# EAGLE design Proyecto_DE (EAGLE 9.5.2)
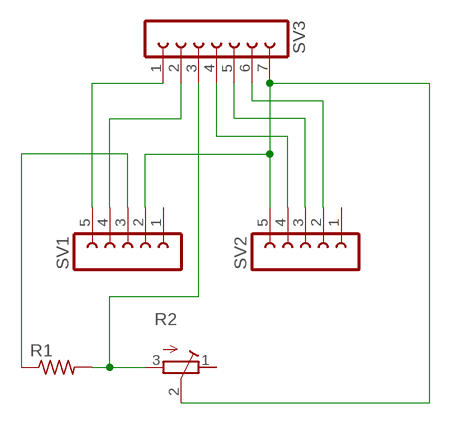
[diagram p0: schematic, sheet 1]

## Parts
R1  R-US_0207/12  [0207/12]
R2  R-TRIMMT93YA  [RTRIMT93YA]
SV1  FE05-1  [FE05-1]
SV2  FE05-1  [FE05-1]
SV3  FE07-1  [FE07]

## Nets
N$1: SV1.5 SV3.1
N$2: SV1.4 SV3.2
N$4: R1.1 SV1.3
N$5: R1.2 R2.3(A) SV3.3
N$7: SV2.4 SV3.4
N$9: SV2.3 SV3.5
N$10: R2.2(S) SV1.2 SV2.5 SV3.7
N$11: SV2.2 SV3.6
Unconnected: R2.1(E) SV1.1 SV2.1

## Library data of the parts
R1 = rcl:R-US_: RESISTOR, American symbol; SPICEPREFIX: R
R2 = rcl:R-TRIMM: Trimm resistor; SPICEMODEL: X; SPICEPREFIXL: POT
SV1 SV2 = con-lsta:FE05-1: FEMALE HEADER; OC_FARNELL: unknown; OC_NEWARK: unknown
SV3 = con-lsta:FE07-1: FEMALE HEADER; OC_FARNELL: unknown; OC_NEWARK: unknown

## Board
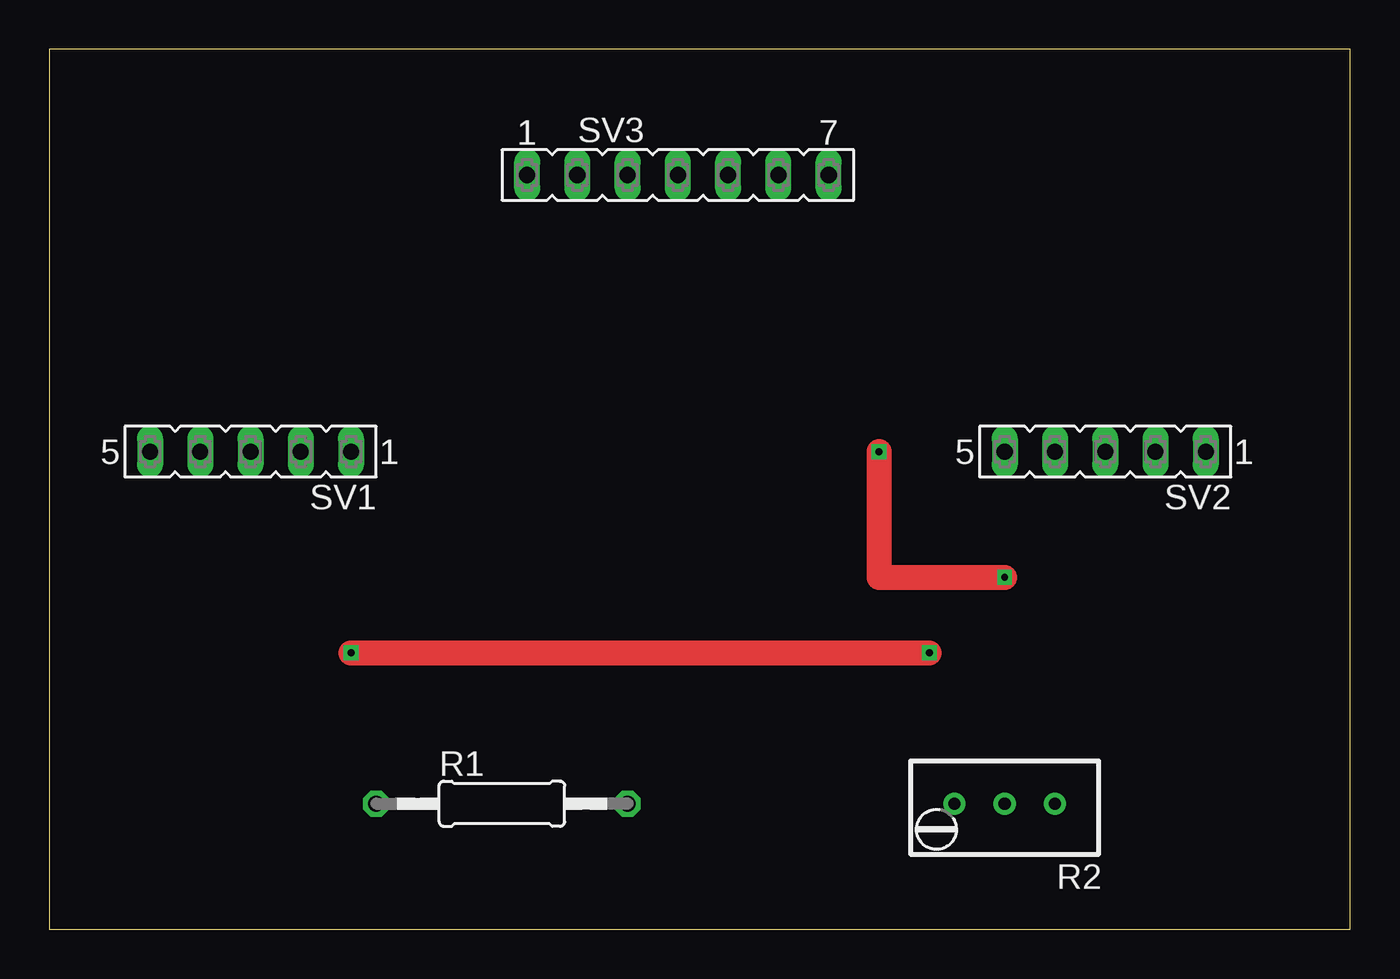
[diagram p1: board, top side]
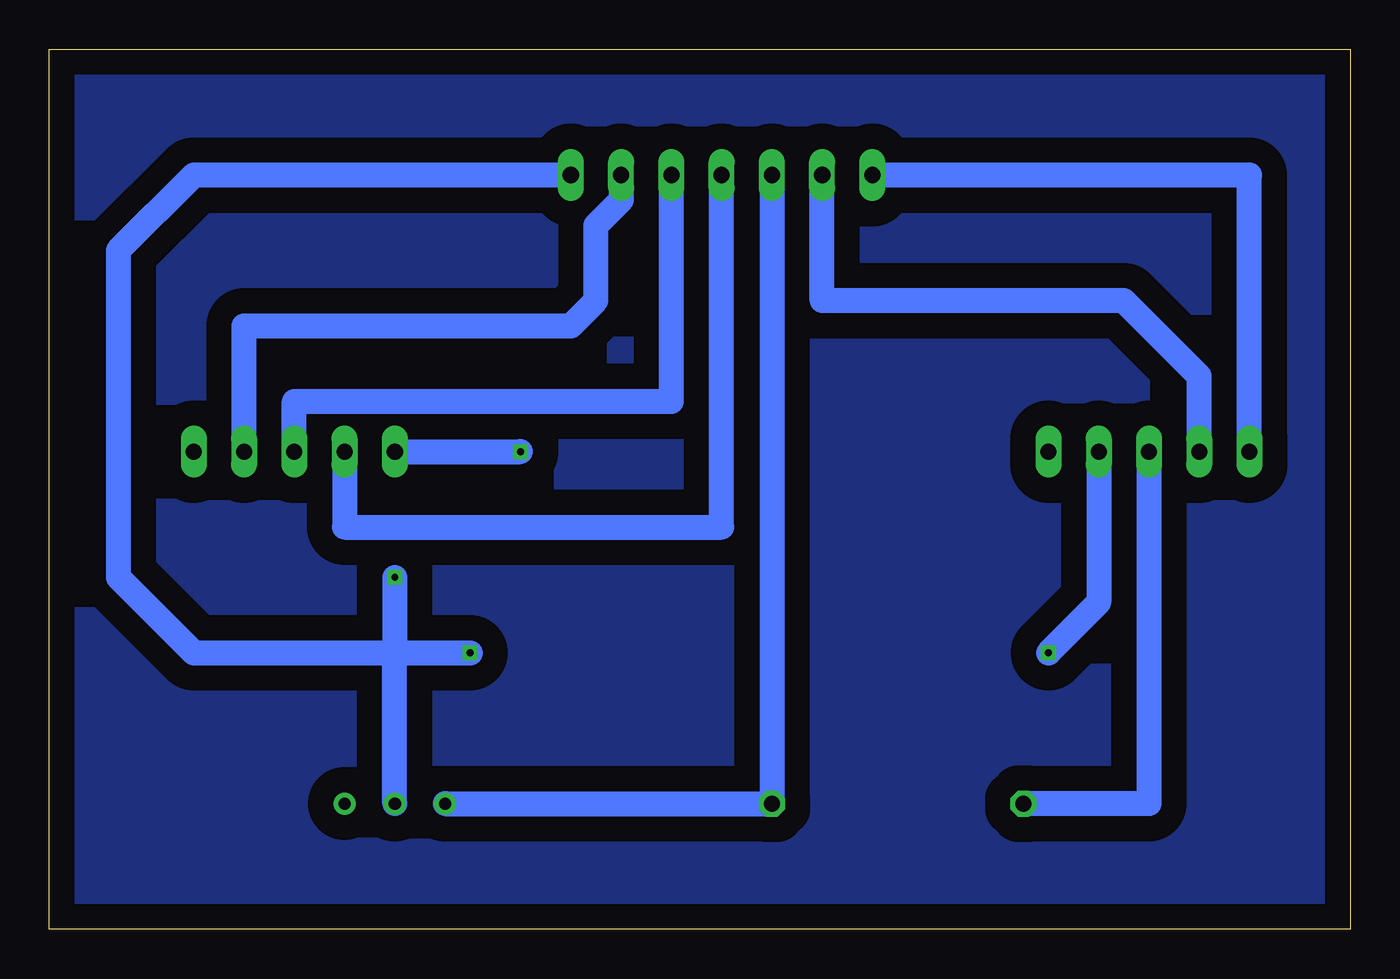
[diagram p2: board, bottom side, seen from below]

Size 65.71 x 44.44 mm. Coordinates in mm from the lower left corner, seen from the top.
Outline: 0,0 65.71,0 65.71,44.44 0,44.44 0,0
Copper layers (1*16): Top 0.035mm / dielectric 1.5mm / Bottom 0.035mm
Design rules "default": minimum track width 6mil, minimum drill 0.35mm, track to track 6mil, track to pad 6mil, pad to pad 6mil, via to via 6mil, smd to smd 6mil, copper to edge 40mil, drill to drill 6mil, minimum pad ring 10mil, minimum via ring 8mil, stop-mask expansion 4mil, vias tented up to drill 0mil, thermal gap 10mil

### Footprints (pad centres in the part's own frame; a part is rotated, then mirrored left to right if it is on the bottom)
0207/12 = drill 0.813 octagon: 1 -6.35,0; 2 6.35,0
RTRIMT93YA = drill 0.61: 1 0,-2.54; 2 0,0; 3 0,2.54
FE05-1 = drill 0.813 long: 1 -5.08,0; 2 -2.54,0; 3 0,0; 4 2.54,0; 5 5.08,0
FE07 = drill 0.813 long: 1 -7.62,0; 2 -5.08,0; 3 -2.54,0; 4 0,0; 5 2.54,0; 6 5.08,0; 7 7.62,0

### Placement (x,y rotation side)
R1  22.86,6.35 0 top
R2  48.26,6.35 90 top
SV1  10.16,24.13 180 top
SV2  53.34,24.13 180 top
SV3  31.75,38.1 0 top

### Tracks (layer width: path | path; a pad name or v marks a point on that pad's centre or on a via)
N$1
  Bottom 1.27: SV1.5 5.08,38.1 SV3.1
N$2
  Bottom 1.27: SV3.2 26.67,31.75 11.43,31.75 7.62,27.94 SV1.4
N$3
  pour Bottom (isolate 1.27): 0,44.45 0,0 66.04,0 66.04,44.45
N$4
  Bottom 1.27: SV1.3 10.16,6.35 R1.1
N$5
  Bottom 1.27: SV3.3 R1.2 R2.3
N$7
  Bottom 1.27: SV2.4 50.8,20.32 31.75,20.32 SV3.4
N$9
  Bottom 1.27: SV2.3 53.34,26.67 34.29,26.67 SV3.5
N$10  (via drill 0.35)
  Top 1.27: v15.24,13.97 v44.45,13.97 | v41.91,24.13 41.91,17.78 v48.26,17.78
  Bottom 1.27: SV1.2 12.7,16.51 v15.24,13.97 | R2.2 48.26,13.97 | SV3.7 58.42,38.1 62.23,34.29 62.23,17.78 58.42,13.97 48.26,13.97 | 48.26,13.97 v44.45,13.97 | SV2.5 v41.91,24.13 | v48.26,17.78 48.26,13.97
N$11
  Bottom 1.27: SV2.2 55.88,30.48 39.37,30.48 38.1,31.75 38.1,35.56 36.83,36.83 SV3.6